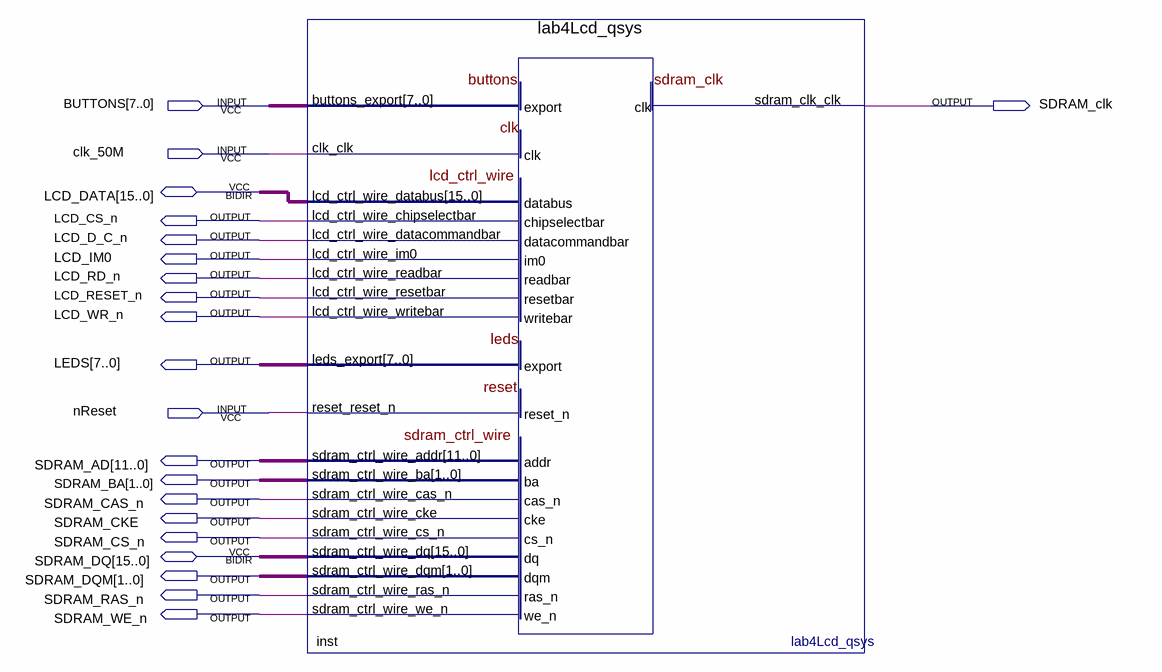
[diagram p0: schematic sheet]
// Quartus schematic lab4Lcd_block.bdf as structural Verilog: 1 symbols, 21 pins
module lab4Lcd_block (
  input  [7:0] BUTTONS,
  input  clk_50M,
  input  nReset,
  inout  [15:0] LCD_DATA,
  inout  [15:0] SDRAM_DQ,
  output SDRAM_clk,
  output LCD_CS_n,
  output LCD_D_C_n,
  output LCD_IM0,
  output LCD_RD_n,
  output LCD_RESET_n,
  output LCD_WR_n,
  output [7:0] LEDS,
  output [11:0] SDRAM_AD,
  output [1:0] SDRAM_BA,
  output SDRAM_CAS_n,
  output SDRAM_CKE,
  output SDRAM_CS_n,
  output [1:0] SDRAM_DQM,
  output SDRAM_RAS_n,
  output SDRAM_WE_n
);

  lab4Lcd_qsys inst (
    .buttons_export(BUTTONS), .clk_clk(clk_50M), .reset_reset_n(nReset),
    .lcd_ctrl_wire_chipselectbar(LCD_CS_n), .lcd_ctrl_wire_datacommandbar(LCD_D_C_n),
    .lcd_ctrl_wire_im0(LCD_IM0), .lcd_ctrl_wire_readbar(LCD_RD_n), .lcd_ctrl_wire_resetbar(LCD_RESET_n),
    .lcd_ctrl_wire_writebar(LCD_WR_n), .leds_export(LEDS), .sdram_clk_clk(SDRAM_clk),
    .sdram_ctrl_wire_addr(SDRAM_AD), .sdram_ctrl_wire_ba(SDRAM_BA), .sdram_ctrl_wire_cas_n(SDRAM_CAS_n),
    .sdram_ctrl_wire_cke(SDRAM_CKE), .sdram_ctrl_wire_cs_n(SDRAM_CS_n), .sdram_ctrl_wire_dqm(SDRAM_DQM),
    .sdram_ctrl_wire_ras_n(SDRAM_RAS_n), .sdram_ctrl_wire_we_n(SDRAM_WE_n), .lcd_ctrl_wire_databus(LCD_DATA),
    .sdram_ctrl_wire_dq(SDRAM_DQ));
endmodule
